# EAGLE design battey (EAGLE 6.5.0)
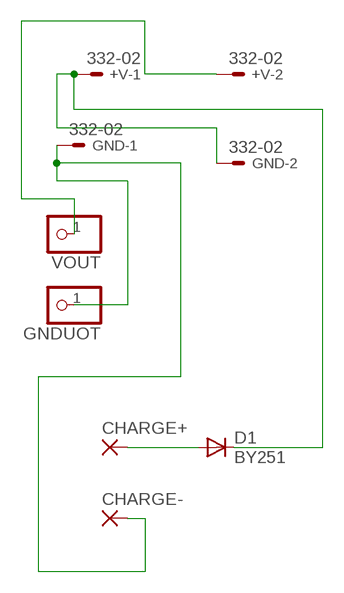
[diagram p0: schematic, sheet 1]

## Parts
+V  332-02  [332-02]
CHARGE+  2,54/1,0  [2,54/1,0]
CHARGE-  2,54/1,0  [2,54/1,0]
D1  BY251  [DO201-15]
GND  332-02  [332-02]
GNDUOT  PINHD-1X1  [1X01]
VOUT  PINHD-1X1  [1X01]

## Nets
N$3: +V.2 VOUT.1
N$4: CHARGE+.1(P) D1.A
N$5: +V.1 D1.C GND.2
N$6: CHARGE-.1(P) GND.1 GNDUOT.1

## Library data of the parts
+V GND = con-garry:332-02: 2 Pin - 2mm Dual Row Source: www.mpe-connector.de / garry_shortform_2012.pdf
CHARGE+ CHARGE- = wirepad:2,54/1,0: THROUGH-HOLE PAD
D1 = diode:BY251: DIODE Si, 200 V, 3 A
GNDUOT VOUT = pinhead:PINHD-1X1: PIN HEADER

## Board
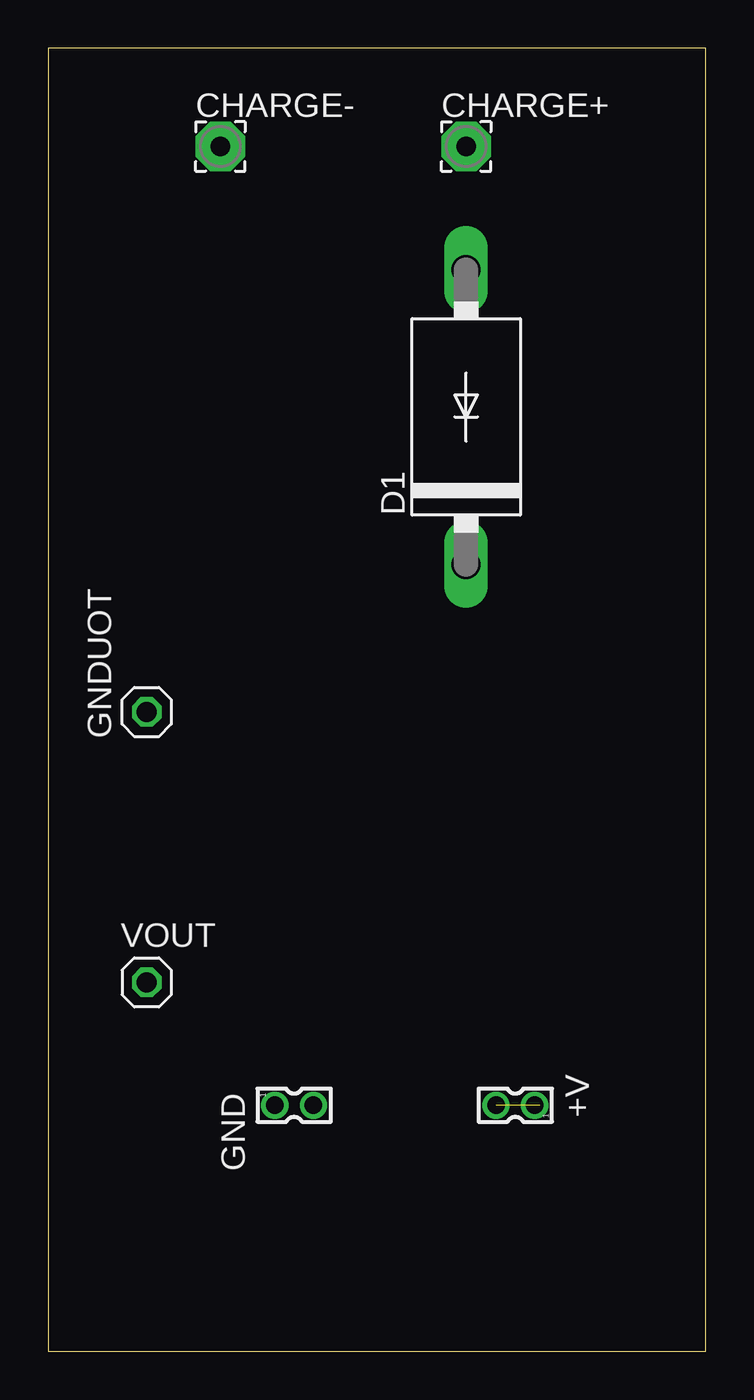
[diagram p1: board, top side]
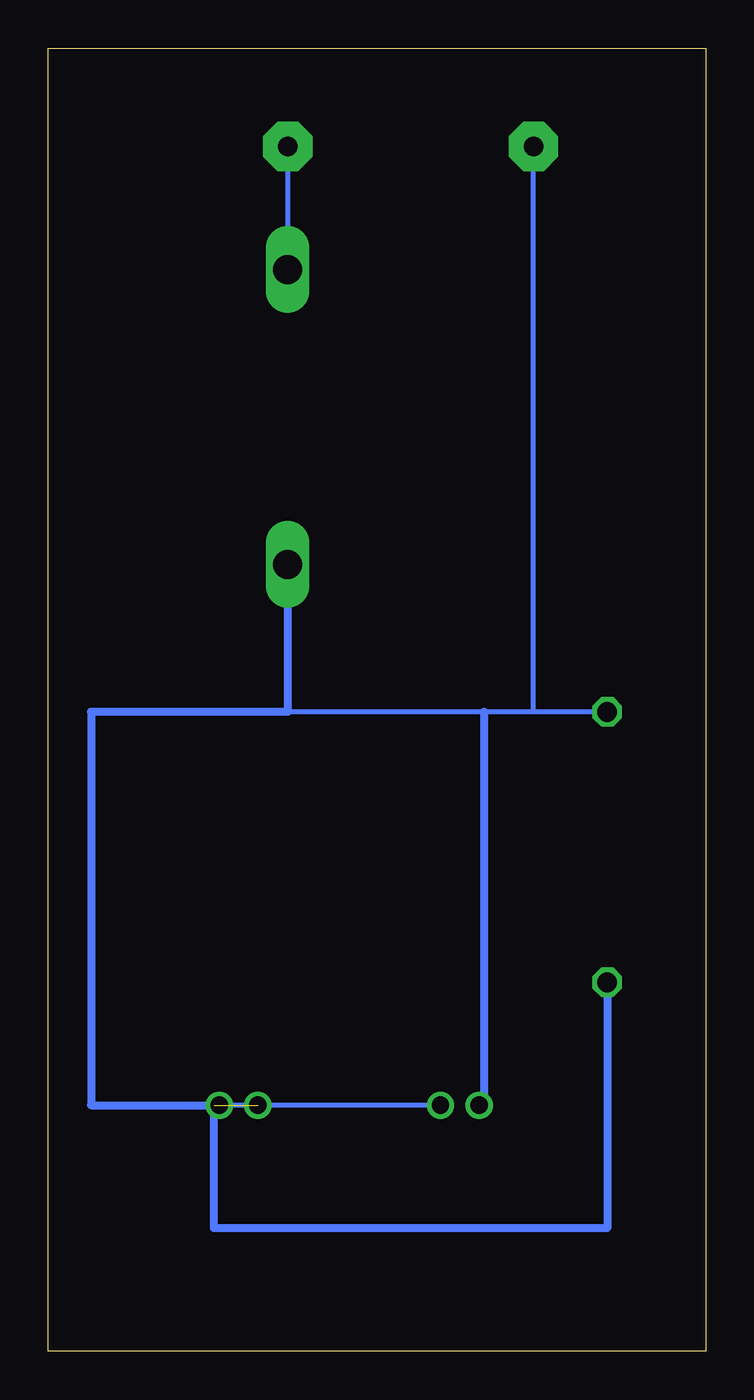
[diagram p2: board, bottom side, seen from below]

Size 33.96 x 67.3 mm. Coordinates in mm from the lower left corner, seen from the top.
Outline: 0,0 33.96,0 33.96,67.3 0,67.3 0,0
Copper layers (1*16): Top 0.035mm / dielectric 1.5mm / Bottom 0.035mm
Design rules "default": minimum track width 10mil, minimum drill 24mil, track to track 8mil, track to pad 8mil, pad to pad 8mil, via to via 8mil, smd to smd 8mil, copper to edge 40mil, drill to drill 8mil, minimum pad ring 10mil, minimum via ring 8mil, stop-mask expansion 4mil, vias tented up to drill 0mil, thermal gap 10mil

### Footprints (pad centres in the part's own frame; a part is rotated, then mirrored left to right if it is on the bottom)
332-02 = drill 0.9 pad 1.27: 1 0,-1; 2 0,1
2,54/1,0 = drill 1.016 pad 2.54 octagon: 1 0,0
DO201-15 = drill 1.499 long: A 7.62,0; C -7.62,0
1X01 = drill 1.016 octagon: 1 0,0

### Placement (x,y rotation side)
+V  24.13,12.7 90 top
CHARGE+  21.59,62.23 0 top
CHARGE-  8.89,62.23 0 top
D1  21.59,48.26 90 top
GND  12.7,12.7 270 top
GNDUOT  5.08,33.02 90 top
VOUT  5.08,19.05 0 top

### Tracks (layer width: path | path; a pad name or v marks a point on that pad's centre or on a via)
N$3  (1 unrouted)
  Bottom 0.406: VOUT.1 5.08,6.35 25.4,6.35 25.4,12.7
N$4
  Bottom 0.254: CHARGE+.1 D1.A
N$5
  Bottom 0.254: GND.2 +V.1
  Bottom 0.406: D1.C 21.59,33.02 31.75,33.02 31.75,12.7 +V.1
N$6
  Bottom 0.254: GNDUOT.1 8.89,33.02 | 8.89,33.02 11.43,33.02 21.59,33.02 | 8.89,33.02 CHARGE-.1
  Bottom 0.406: GND.1 11.43,12.7 11.43,33.02